# EAGLE design logic (EAGLE 4.16)
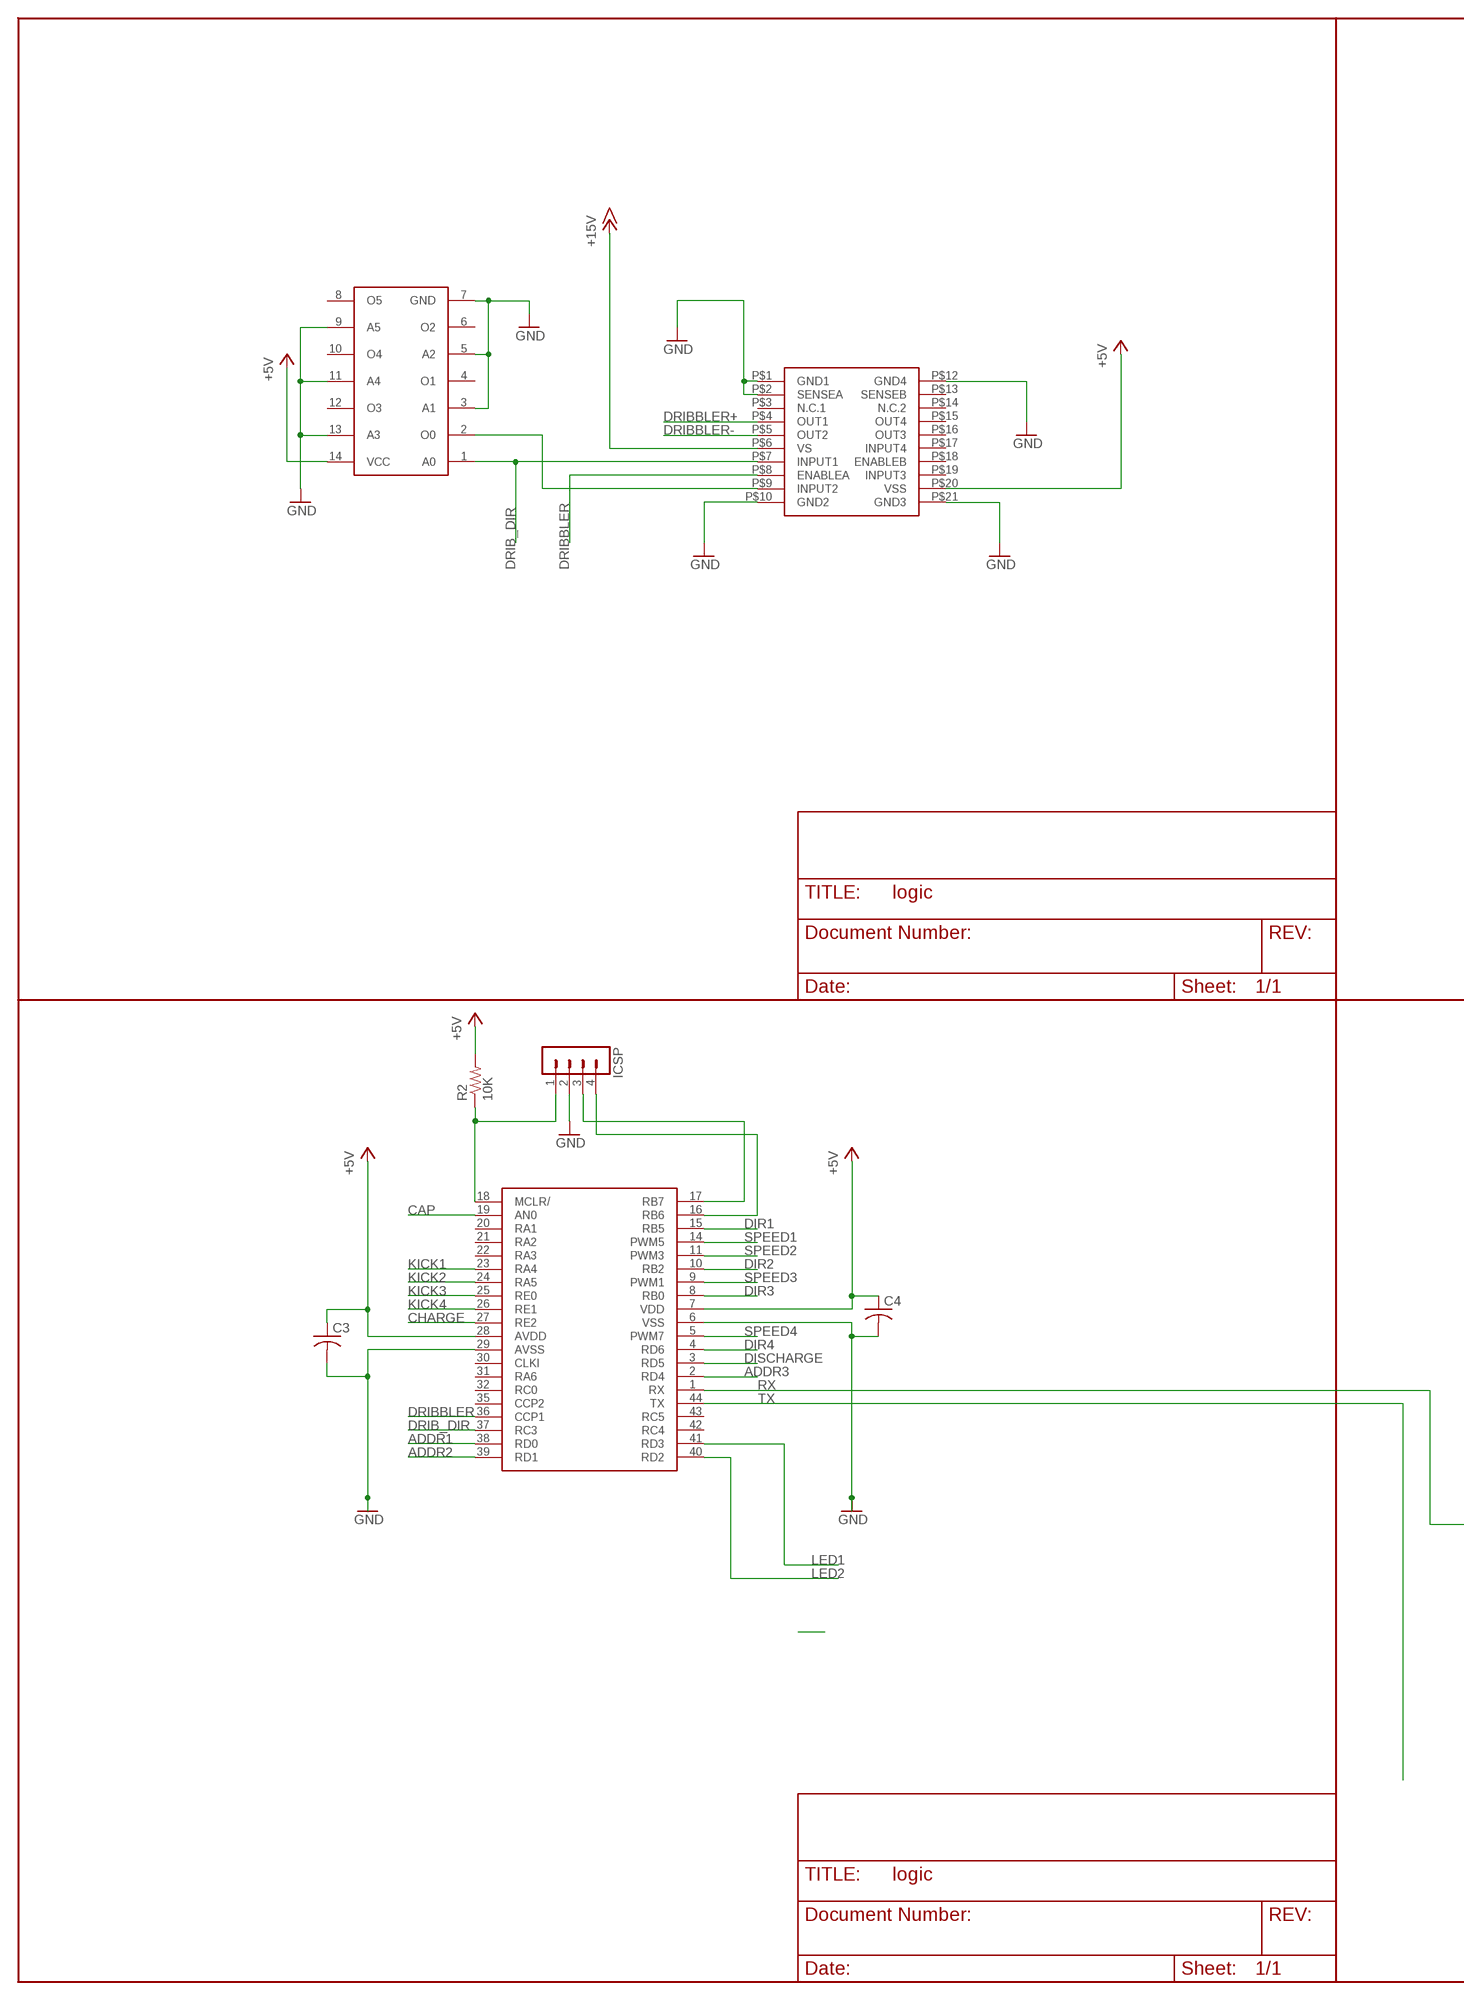
[diagram p0: schematic, sheet 1, part 1 of 2]
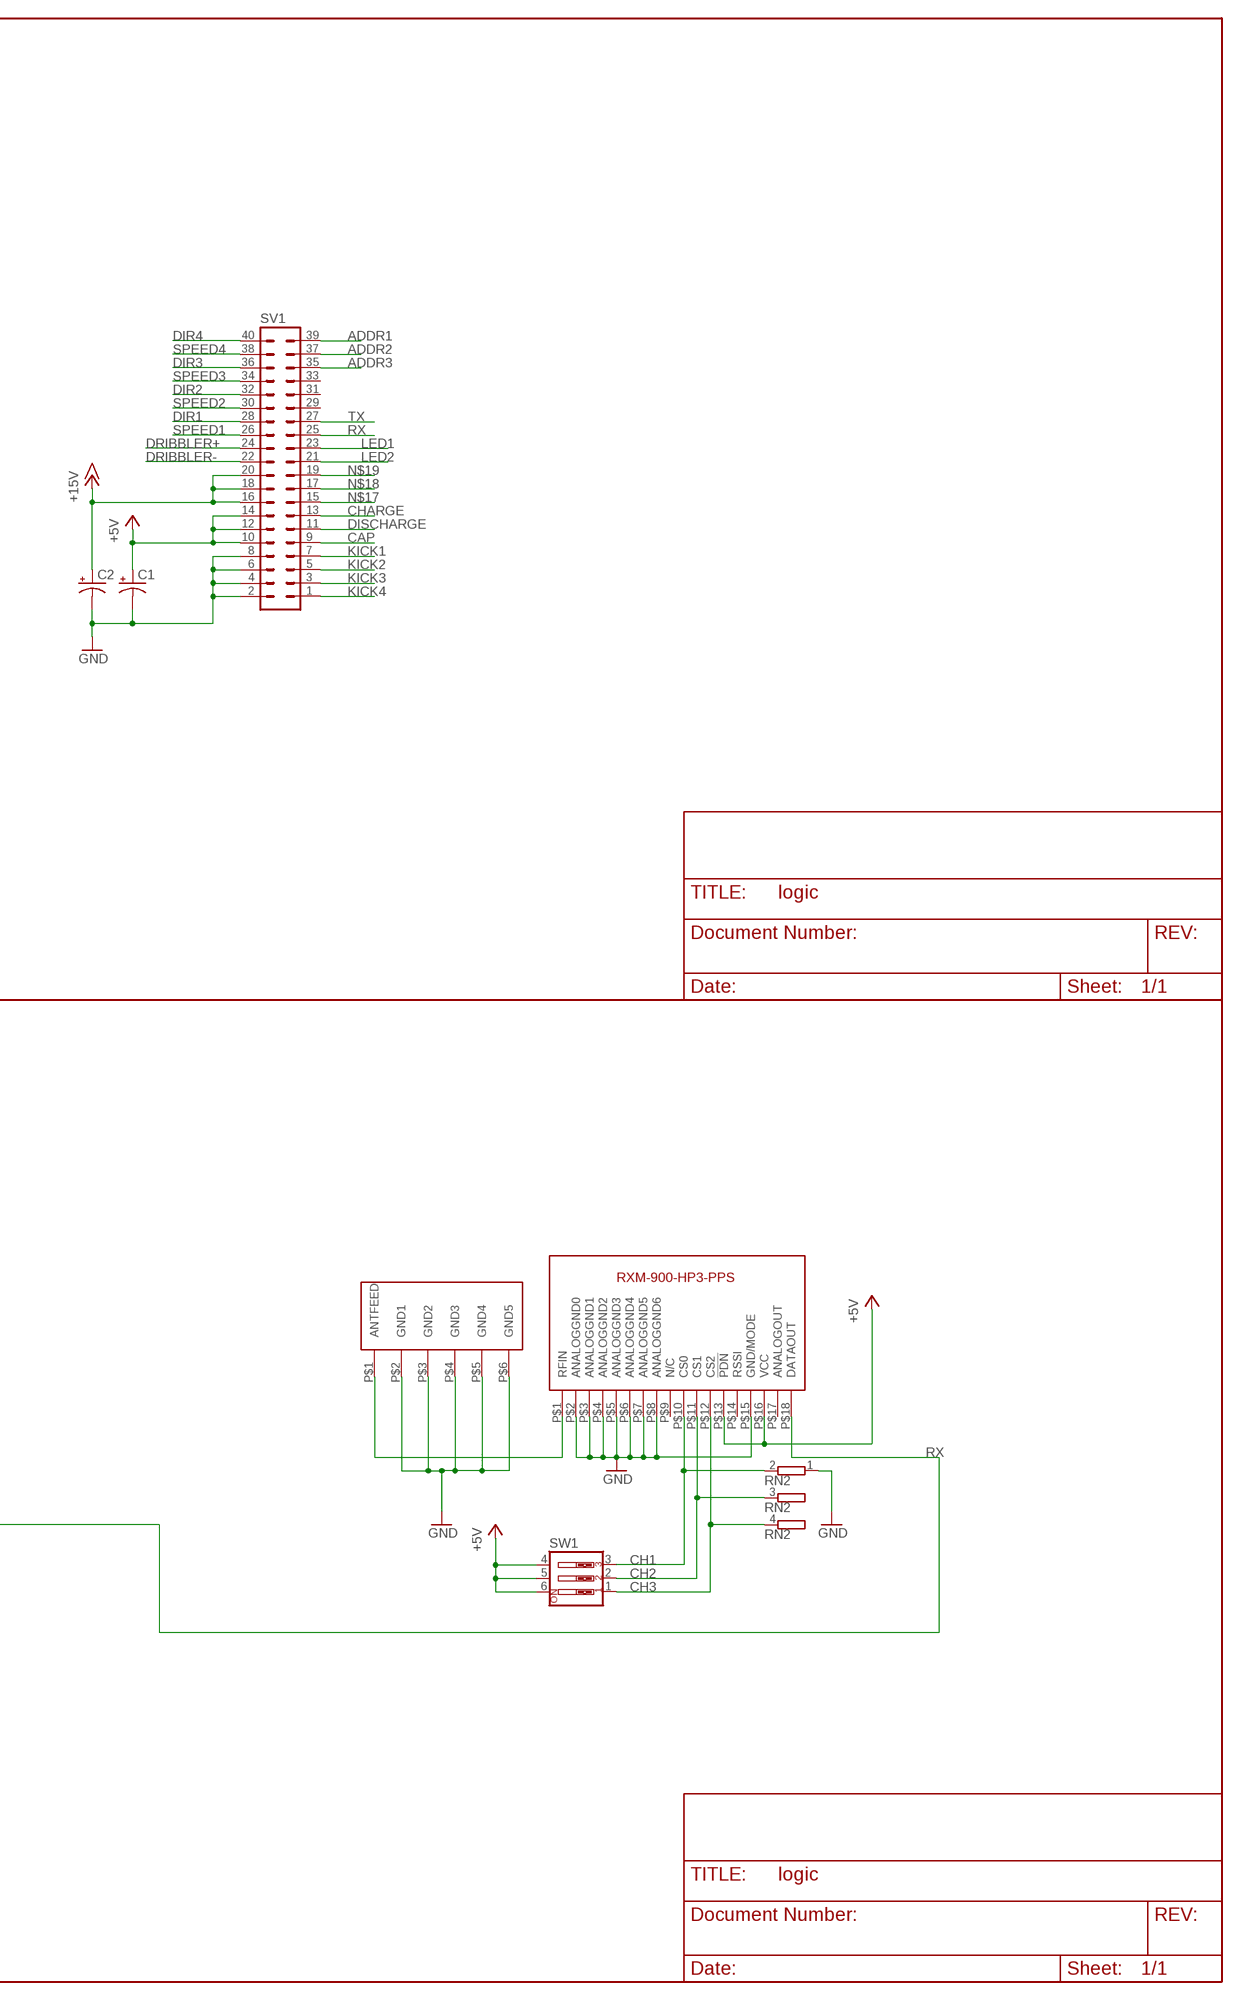
[diagram p1: schematic, sheet 1, part 2 of 2]

## Parts
C1  CPOL-USTT2D5  [TT2D5]
C2  CPOL-USTT2D5  [TT2D5]
C3  C-USC0805  [C0805]
C4  C-USC0805  [C0805]
IC1  PIC18F4431  [TQFP44]
IC2  L298  [L298]
IC3  INVERTER  [SOP14]
ICSP  MA04-1  [MA04-1]
R2  10K  R-US_R1206  [R1206]
RADIO  RXM-900-HP3-PPS  [SIP-18]
RN2  GE03RP  [SIL4]
SV1  MA20-2W  [MA20-2W]
SW1  SW_DIP-3  [EDG-03]
U$6  ANT-916-SP  [ANT-916-SP]

## Nets
+5V [supply]: C1.+ C3.1 C4.1 IC1.7(VDD) IC1.28(AVDD) IC2.P$20(VSS) IC3.14(VCC) R2.2 RADIO.P$13(!PDN) RADIO.P$16(VCC) SV1.10 SV1.12 SV1.14 SW1.4 SW1.5 SW1.6
+15V [supply]: C2.+ IC2.P$6(VS) SV1.16 SV1.18 SV1.20
ADDR1: IC1.38(RD0) SV1.39
ADDR2: IC1.39(RD1) SV1.37
ADDR3: IC1.2(RD4) SV1.35
CAP: IC1.19(AN0) SV1.9
CH1: RADIO.P$10(CS0) RN2.2 SW1.3
CH2: RADIO.P$11(CS1) RN2.3 SW1.2
CH3: RADIO.P$12(CS2) RN2.4 SW1.1
CHARGE: IC1.27(RE2) SV1.13
DIR1: IC1.15(RB5) SV1.28
DIR2: IC1.10(RB2) SV1.32
DIR3: IC1.8(RB0) SV1.36
DIR4: IC1.4(RD6) SV1.40
DISCHARGE: IC1.3(RD5) SV1.11
DRIB_DIR: IC1.37(RC3) IC2.P$7(INPUT1) IC3.1(A0)
DRIBBLER: IC1.36(CCP1) IC2.P$8(ENABLEA)
DRIBBLER+: IC2.P$4(OUT1) SV1.24
DRIBBLER-: IC2.P$5(OUT2) SV1.22
GND [supply]: C1.- C2.- C3.2 C4.2 IC1.6(VSS) IC1.29(AVSS) IC2.P$1(GND1) IC2.P$2(SENSEA) IC2.P$10(GND2) IC2.P$12(GND4) IC2.P$21(GND3) IC3.3(A1) IC3.5(A2) IC3.7(GND) IC3.9(A5) IC3.11(A4) IC3.13(A3) ICSP.2 RADIO.P$2(ANALOGGND0) RADIO.P$3(ANALOGGND1) RADIO.P$4(ANALOGGND2) RADIO.P$5(ANALOGGND3) RADIO.P$6(ANALOGGND4) RADIO.P$7(ANALOGGND5) RADIO.P$8(ANALOGGND6) RADIO.P$15(GND/MODE) RN2.1 SV1.2 SV1.4 SV1.6 SV1.8 U$6.P$2(GND1) U$6.P$3(GND2) U$6.P$4(GND3) U$6.P$5(GND4) U$6.P$6(GND5)
KICK1: IC1.23(RA4) SV1.7
KICK2: IC1.24(RA5) SV1.5
KICK3: IC1.25(RE0) SV1.3
KICK4: IC1.26(RE1) SV1.1
LED1: IC1.41(RD3) SV1.23
LED2: IC1.40(RD2) SV1.21
N$6: IC1.18(MCLR/) ICSP.1 R2.1
N$7: IC1.17(RB7) ICSP.3
N$8: IC1.16(RB6) ICSP.4
N$17: SV1.15
N$18: SV1.17
N$19: SV1.19
N$45: RADIO.P$1(RFIN) U$6.P$1(ANTFEED)
N$50: IC2.P$9(INPUT2) IC3.2(O0)
RX: IC1.1(RX) RADIO.P$18(DATAOUT) SV1.25
SPEED1: IC1.14(PWM5) SV1.26
SPEED2: IC1.11(PWM3) SV1.30
SPEED3: IC1.9(PWM1) SV1.34
SPEED4: IC1.5(PWM7) SV1.38
TX: IC1.44(TX) SV1.27
Unconnected: IC1.20(RA1) IC1.21(RA2) IC1.22(RA3) IC1.30(CLKI) IC1.31(RA6) IC1.32(RC0) IC1.35(CCP2) IC1.42(RC4) IC1.43(RC5) IC2.P$3(N.C.1) IC2.P$13(SENSEB) IC2.P$14(N.C.2) IC2.P$15(OUT4) IC2.P$16(OUT3) IC2.P$17(INPUT4) IC2.P$18(ENABLEB) IC2.P$19(INPUT3) IC3.4(O1) IC3.6(O2) IC3.8(O5) IC3.10(O4) IC3.12(O3) RADIO.P$9(N/C) RADIO.P$14(RSSI) RADIO.P$17(ANALOGOUT) SV1.29 SV1.31 SV1.33

## Library data of the parts
C1 C2 = rcl:CPOL-US: POLARIZED CAPACITOR, American symbol
C3 C4 = rcl:C-US: CAPACITOR, American symbol
IC1 = microchip:PIC18F4431
IC2 = L298:L298
IC3 = smd-ipc:INVERTER
ICSP = con-lstb:MA04-1: PIN HEADER
R2 = rcl:R-US_: RESISTOR, American symbol
RADIO = linxtechnologies:RXM-900-HP3-PPS
RN2 = resistor-sil:GE03RP: SIL RESISTOR
SV1 = con-lstb:MA20-2W: PIN HEADER
SW1 = special:SW_DIP-3: DIP SWITCH
U$6 = smd-oscillator:ANT-916-SP

## Net classes
1 supply: width 0.508 mm

## Board
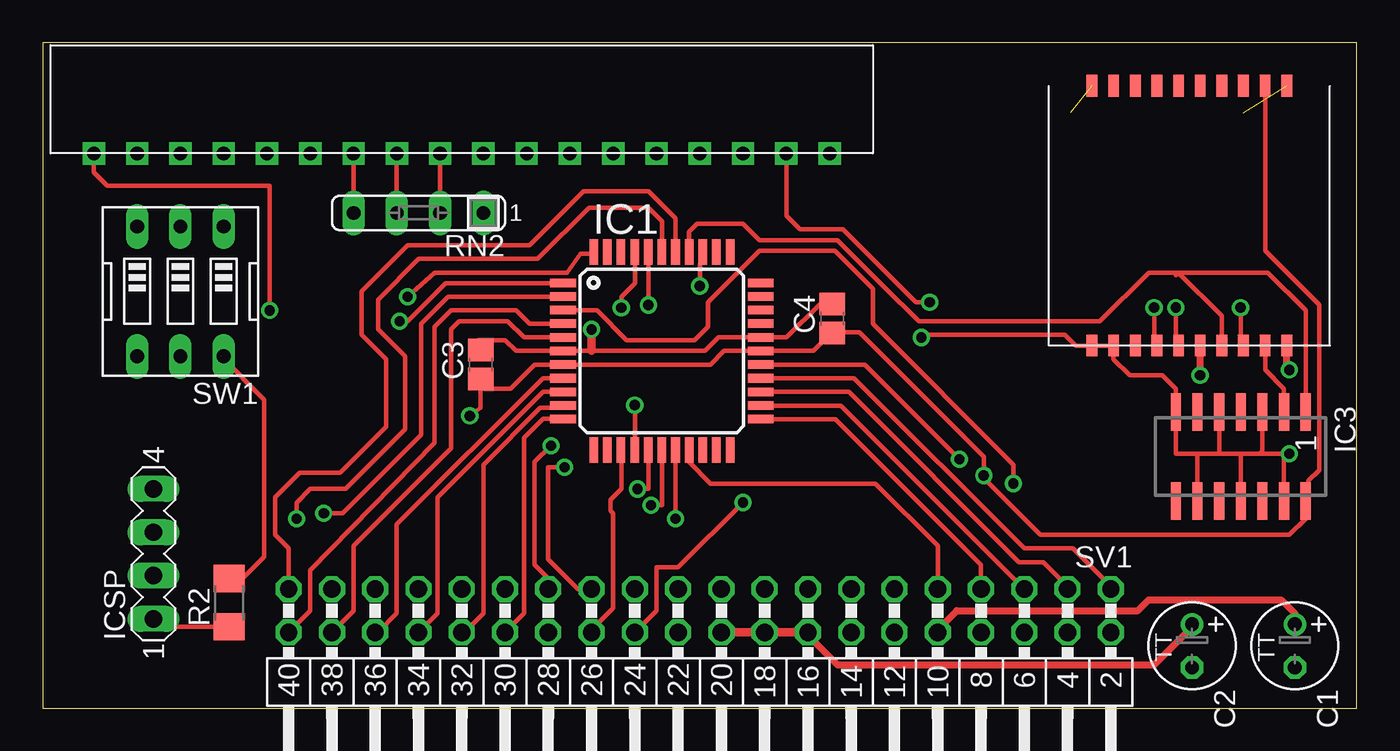
[diagram p2: board, top side]
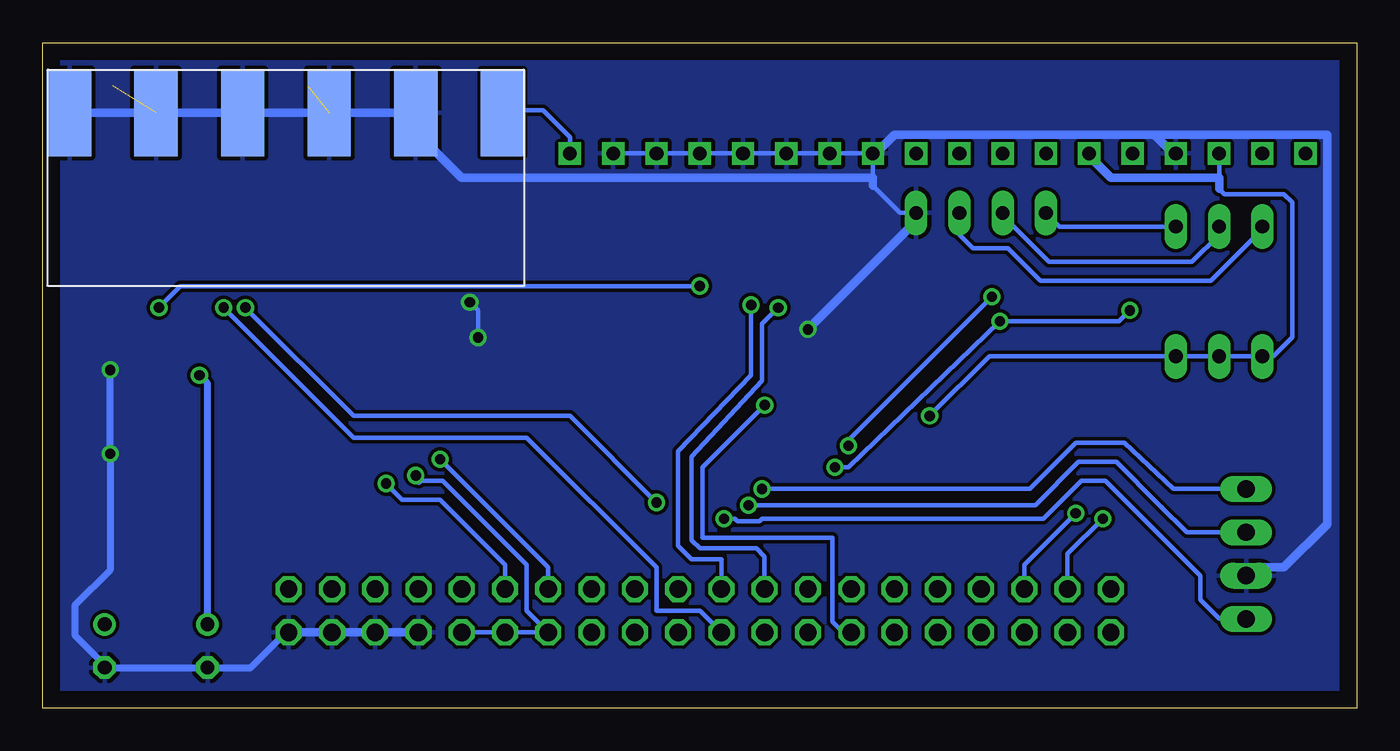
[diagram p3: board, bottom side, seen from below]

Size 77.14 x 39.04 mm. Coordinates in mm from the lower left corner, seen from the top.
Outline: 0,0 77.14,0 77.14,39.04 0,39.04 0,0
Copper layers (1*16): Top 0.035mm / dielectric 1.5mm / Bottom 0.035mm
Design rules "default": minimum track width 10mil, minimum drill 24mil, track to track 8mil, track to pad 8mil, pad to pad 8mil, via to via 8mil, smd to smd 8mil, copper to edge 40mil, drill to drill 8mil, minimum pad ring 10mil, minimum via ring 8mil, stop-mask expansion 4mil, vias tented up to drill 0mil, thermal gap 10mil

### Footprints (pad centres in the part's own frame; a part is rotated, then mirrored left to right if it is on the bottom)
TT2D5 = drill 0.813 round: + -1.27,0 | drill 0.813 octagon: - 1.27,0
C0805 = smd 1.3 x 1.5: 1 -0.85,0; 2 0.85,0
TQFP44 = smd 1.5 x 0.5: 1 -5.8,4; 2 -5.8,3.2; 3 -5.8,2.4; 4 -5.8,1.6; 5 -5.8,0.8; 6 -5.8,0; 7 -5.8,-0.8; 8 -5.8,-1.6; 9 -5.8,-2.4; 10 -5.8,-3.2; 11 -5.8,-4; 23 5.8,-4; 24 5.8,-3.2; 25 5.8,-2.4; 26 5.8,-1.6; 27 5.8,-0.8; 28 5.8,0; 29 5.8,0.8; 30 5.8,1.6; 31 5.8,2.4; 32 5.8,3.2; 33 5.8,4 | smd 0.5 x 1.5: 12 -4,-5.8; 13 -3.2,-5.8; 14 -2.4,-5.8; 15 -1.6,-5.8; 16 -0.8,-5.8; 17 0,-5.8; 18 0.8,-5.8; 19 1.6,-5.8; 20 2.4,-5.8; 21 3.2,-5.8; 22 4,-5.8; 34 4,5.8; 35 3.2,5.8; 36 2.4,5.8; 37 1.6,5.8; 38 0.8,5.8; 39 0,5.8; 40 -0.8,5.8; 41 -1.6,5.8; 42 -2.4,5.8; 43 -3.2,5.8; 44 -4,5.8
L298 = smd 0.635 x 1.27: P$1 2.54,0; P$2 3.81,0; P$3 5.08,0; P$4 6.35,0; P$5 7.62,0; P$6 8.89,0; P$7 10.16,0; P$8 11.43,0; P$9 12.7,0; P$10 13.97,0; P$12 2.54,15.24; P$13 3.81,15.24; P$14 5.08,15.24; P$15 6.35,15.24; P$16 7.62,15.24; P$17 8.89,15.24; P$18 10.16,15.24; P$19 11.43,15.24; P$20 12.7,15.24; P$21 13.97,15.24
SOP14 = smd 0.6 x 2.2: 1 -3.81,-2.6; 2 -2.54,-2.6; 3 -1.27,-2.6; 4 0,-2.6; 5 1.27,-2.6; 6 2.54,-2.6; 7 3.81,-2.6; 8 3.81,2.6; 9 2.54,2.6; 10 1.27,2.6; 11 0,2.6; 12 -1.27,2.6; 13 -2.54,2.6; 14 -3.81,2.6
MA04-1 = drill 1.016 long: 1 -3.81,0; 2 -1.27,0; 3 1.27,0; 4 3.81,0
R1206 = smd 1.6 x 1.803: 1 -1.422,0; 2 1.422,0
SIP-18 = drill 0.8 square: P$1 0,0; P$2 2.54,0; P$3 5.08,0; P$4 7.62,0; P$5 10.16,0; P$6 12.7,0; P$7 15.24,0; P$8 17.78,0; P$9 20.32,0; P$10 22.86,0; P$11 25.4,0; P$12 27.94,0; P$13 30.48,0; P$14 33.02,0; P$15 35.56,0; P$16 38.1,0; P$17 40.64,0; P$18 43.18,0
SIL4 = drill 0.813 long: 1 -3.81,0; 2 -1.27,0; 3 1.27,0; 4 3.81,0
MA20-2W = drill 1.016 octagon: 1 -24.13,-1.27; 2 -24.13,1.27; 3 -21.59,-1.27; 4 -21.59,1.27; 5 -19.05,-1.27; 6 -19.05,1.27; 7 -16.51,-1.27; 8 -16.51,1.27; 9 -13.97,-1.27; 10 -13.97,1.27; 11 -11.43,-1.27; 12 -11.43,1.27; 13 -8.89,-1.27; 14 -8.89,1.27; 15 -6.35,-1.27; 16 -6.35,1.27; 17 -3.81,-1.27; 18 -3.81,1.27; 19 -1.27,-1.27; 20 -1.27,1.27; 21 1.27,-1.27; 22 1.27,1.27; 23 3.81,-1.27; 24 3.81,1.27; 25 6.35,-1.27; 26 6.35,1.27; 27 8.89,-1.27; 28 8.89,1.27; 29 11.43,-1.27; 30 11.43,1.27; 31 13.97,-1.27; 32 13.97,1.27; 33 16.51,-1.27; 34 16.51,1.27; 35 19.05,-1.27; 36 19.05,1.27; 37 21.59,-1.27; 38 21.59,1.27; 39 24.13,-1.27; 40 24.13,1.27
EDG-03 = drill 0.813 long: 1 -2.54,-3.81; 2 0,-3.81; 3 2.54,-3.81; 4 2.54,3.81; 5 0,3.81; 6 -2.54,3.81
ANT-916-SP = smd 2.54 x 5.08: P$1 -7.62,0; P$2 -2.54,0; P$3 2.54,0; P$4 7.62,0; P$5 12.7,0; P$6 17.78,0

### Placement (x,y rotation side)
C1  73.5,3.65 270 top
C2  67.46,3.65 270 top
C3  25.71,20.16 90 top
C4  46.35,22.86 90 top
IC1  36.35,20.95 0 top
IC2  59.05,21.27 0 top
IC3  70.32,14.76 180 top
ICSP  6.5,9.04 90 top
R2  10.95,6.19 90 top
RADIO  46.19,32.54 180 top
RN2  22.06,29.05 180 top
SV1  38.57,5.71 180 top
SW1  8.09,24.44 180 top
U$6  57.78,34.92 180 bottom

### Tracks (layer width: path | path; a pad name or v marks a point on that pad's centre or on a via)
+5V  (via drill 0.6)  (1 unrouted)
  Top 0.254: 25.71,18.73 | 25.71,18.73 C3.1 25.71,17.62 v25.08,17.14 | 25.71,18.73 27.46,18.73 28.88,20.15 IC1.7 39.2,20.15 40,20.95 IC1.28 45.24,20.95 46.35,22.06 | 46.35,22.06 | 46.35,22.06 C4.1 | 46.35,22.06 47.94,22.06 55.24,14.76 v55.24,13.65 55.08,13.65 58.57,10.16 73.18,10.16 74.13,11.11 IC3.14 74.19,12.16 74.29,12.06 74.29,13.33 74.92,13.97 74.92,23.65 71.75,26.82 IC2.P$20 | 10.47,20.63 10.31,20.47 | 10.47,20.63 SW1.6 | 10.47,20.63 | R2.2 11.74,7.61 13.01,8.89 13.01,18.09 10.47,20.63 | 10.47,20.63
  Top 0.406: C1.+ 73.5,5.55 72.7,6.34 64.92,6.34 64.29,5.71 53.65,5.71 52.54,4.6 SV1.10
  Bottom 0.254: SV1.14 48.73,5.71 48.73,8.41 53.65,13.33 54.92,13.33 v55.24,13.65 | SV1.10 SV1.12 SV1.14 | SV1.14 47.3,4.44 | 8.09,31.11 RADIO.P$16 | 8.09,30.47 7.77,30.16 4.28,30.16 3.8,29.68 3.8,21.74 4.92,20.63 SW1.4 | SW1.4 | SW1.4 | SW1.4 8.41,20.63 SW1.5 SW1.6 | SW1.6 | SW1.6 10.79,20.47 | v25.08,17.14 21.58,20.63 10.47,20.63
  Bottom 0.508: v55.24,13.65 55.08,13.33 | RADIO.P$13 15.71,32.38 14.44,31.11 8.09,31.11 8.09,30.47
+15V  (via drill 0.6)
  Top 0.406: SV1.16 44.92,4.28 46.67,2.54 65.24,2.54 67.62,4.92 | 67.62,4.92 | 67.62,4.92 C2.+ | 67.94,21.43 | 67.94,21.43 IC2.P$6 | v67.94,19.52 67.94,21.43
  Top 0.508: SV1.20 SV1.18 SV1.16
  Bottom 0.406: C2.+ 67.46,19.04 v67.94,19.52
ADDR1
  Top 0.254: SV1.39 14.44,9.36 13.65,10.16 13.65,12.38 15.08,13.81 17.46,13.81 20.15,16.5 20.15,20.47 18.73,21.9 18.73,24.44 21.42,27.14 28.57,27.14 31.74,30.32 35.55,30.32 37.14,28.73 37.14,26.82 37.15,26.82 IC1.38
ADDR2  (via drill 0.6)
  Top 0.254: v14.92,11.11 14.92,12.06 15.71,12.85 17.77,12.85 20.95,16.03 | 20.95,16.03 | 20.95,16.03 21.27,16.35 21.27,20.63 19.68,22.22 19.68,23.97 22.06,26.35 29.04,26.35 32.06,29.36 35.55,29.36 36.35,28.57 36.35,26.66 IC1.39
  Bottom 0.254: SV1.37 16.98,9.04 v14.92,11.11
ADDR3  (via drill 0.6)
  Top 0.254: v16.5,11.43 17.61,11.43 22.22,16.03 22.22,22.54 23.81,24.12 30.63,24.12 30.61,24.15 IC1.2
  Bottom 0.254: SV1.35 19.52,8.41 v16.5,11.43
CAP
  Top 0.254: SV1.9 52.54,9.52 48.89,13.17 39.2,13.17 37.94,14.44 37.94,15.24 37.95,15.22 IC1.19
CH1
  Top 0.254: RN2.2 23.33,28.89 | 23.33,28.89 RADIO.P$10 | 23.33,28.89 23.17,28.73
  Bottom 0.254: SW1.3 5.55,28.09 8.57,25.08 18.57,25.08 20.47,26.98 22.54,26.98 23.33,27.78 RN2.2
CH2
  Top 0.254: RN2.3 RADIO.P$11
  Bottom 0.254: SW1.2 8.09,27.78 9.68,26.19 18.09,26.19 20.79,28.89 RN2.3
CH3
  Top 0.254: 18.25,28.89 RN2.4 RADIO.P$12
  Bottom 0.254: SW1.1 17.46,28.25 RN2.4
CHARGE  (via drill 0.6)
  Top 0.254: v53.81,14.6 | v53.81,14.6 48.25,20.16 41.9,20.16 41.91,20.15 IC1.27
  Bottom 0.254: SV1.13 47.46,8.25 v53.81,14.6
DIR1  (via drill 0.6)
  Top 0.254: IC1.15 34.75,14.93 34.76,14.92 v34.76,17.77
  Bottom 0.254: SV1.28 30.16,4.44 30.79,5.08 30.79,10 38.41,10 38.41,14.12 v34.76,17.77
DIR2
  Top 0.254: SV1.32 24.76,4.44 25.87,5.55 25.87,14.28 29.2,17.62 30.79,17.62 30.66,17.75 IC1.10
DIR3
  Top 0.254: SV1.36 19.68,4.44 20.79,5.55 20.79,10.79 29.36,19.36 30.63,19.36 30.62,19.35 IC1.8
DIR4
  Top 0.254: SV1.40 15.71,5.71 15.71,8.09 23.01,15.55 23.01,22.38 23.96,23.33 27.77,23.33 28.57,22.54 30.47,22.54 30.49,22.55 IC1.4
DISCHARGE  (via drill 0.6)
  Top 0.254: v56.98,13.17 56.98,14.28 48.73,22.54 48.73,24.6 46.51,26.82 42.06,26.82 39.05,23.81 39.05,22.38 38.25,21.58 34.28,21.58 32.54,23.33 30.47,23.33 30.49,23.35 IC1.3
  Bottom 0.254: SV1.11 50,8.41 53.81,12.22 56.03,12.22 v56.98,13.17
DRIB_DIR
  Top 0.254: IC1.37 37.95,27.95 38.41,28.41 41.11,28.41 42.06,27.46 46.67,27.46 49.37,24.76 51.43,22.7 62.06,22.7 64.92,25.55 66.51,25.55 | 66.51,25.55 66.67,25.55 | 66.67,25.55 69.21,23.01 IC2.P$7 | IC2.P$7 | IC3.1 74.13,23.33 71.91,25.55 66.67,25.55 | 66.51,25.55 66.51,25.39 66.67,25.55
DRIBBLER  (via drill 0.61)
  Top 0.254: v70.32,23.49 70.32,20.95 IC2.P$8 | v38.57,24.76 38.57,26.03 IC1.36
  Bottom 0.254: v70.32,23.49 69.05,24.76 v38.57,24.76
DRIBBLER+  (via drill 0.61)
  Top 0.254: v65.24,23.49 65.24,20.95 IC2.P$4 | v41.11,12.06 37.3,8.25 36.03,8.25 36.03,5.71 SV1.24
  Bottom 0.254: v65.24,23.49 58.89,17.14 46.19,17.14 v41.11,12.06
DRIBBLER-  (via drill 0.61)
  Top 0.254: v66.51,23.49 66.51,20.95 IC2.P$5
  Bottom 0.254: v66.51,23.49 58.89,15.87 48.73,15.87 41.11,8.25 41.11,5.71 38.57,5.71 SV1.22
GND  (via drill 0.6, 0.61)  (2 unrouted)
  Top 0.254: C3.2 25.58,21.56 25.55,21.58 27.14,21.58 27.77,20.95 IC1.6 32.22,20.95 38.89,20.95 39.68,21.74 41.9,21.74 | 41.9,21.74 42.22,21.74 42.21,21.75 IC1.29 41.91,21.75 41.9,21.74 | C4.2 45.61,23.7 43.65,21.74 41.9,21.74 | 66.51,14.92 IC3.7 66.51,17.3 | 66.51,14.92 | 67.78,14.92 69.05,14.92 | 66.51,14.92 67.78,14.92 | 69.05,17.3 | 69.05,17.3 IC3.5 | 69.05,14.92 69.05,17.3 | IC3.11 70.32,14.92 | 69.05,14.92 70.32,14.92 | 71.59,15.08 IC3.3 71.59,14.92 | 71.59,15.08 | 71.43,14.92 71.59,15.08 | 70.32,14.92 71.43,14.92 | IC3.9 67.78,14.92 | IC3.13 72.86,14.92 72.7,14.92 71.59,14.92 | 71.43,14.92 71.59,14.92 | 71.59,14.92 v73.18,14.92 | 66.51,17.3 | 66.51,17.3 66.51,18.73 65.72,19.52 63.81,19.52 62.86,20.47 IC2.P$2 63.02,21.27 | 63.02,21.27 IC2.P$1 60.64,21.27 60,21.9 51.75,21.9 v51.59,21.74 | 63.02,21.27 | v52.06,23.81 51.27,23.81 46.98,28.09 44.44,28.09 43.65,28.89 RADIO.P$2 | RADIO.P$2 | RADIO.P$2 43.49,32.7 | RADIO.P$8
  Top 0.406: IC2.P$10 73.02,20.31 v73.18,19.84
  Top 0.508: v32.22,22.22 32.22,20.95
  Bottom 0.254: RN2.1 26.82,29.05 28.41,30.63 | RADIO.P$8 | 28.41,32.38 28.41,31.11 | RADIO.P$8 RADIO.P$7 | RADIO.P$7 31.11,32.54 | 31.11,32.54 | RADIO.P$7 RADIO.P$6 | RADIO.P$6 33.81,32.54 | 33.81,32.54 | RADIO.P$5 | RADIO.P$6 RADIO.P$5 | RADIO.P$5 | RADIO.P$5 RADIO.P$4 | RADIO.P$4 38.73,32.54 | 38.73,32.54 | RADIO.P$4 RADIO.P$3 | RADIO.P$3 41.27,32.54 | 41.27,32.54 | 43.81,32.54 RADIO.P$2 | RADIO.P$3 43.81,32.54 | 43.81,32.54 | v51.59,21.74 51.59,23.33 v52.06,23.81
  Bottom 0.406: v73.18,19.84 v73.18,14.92 73.18,8.09 75.24,6.03 75.24,4.28 73.34,2.38 C1.- | C1.- | C1.- C2.- 64.92,2.38 62.86,4.44 SV1.2 | C1.-
  Bottom 0.508: SV1.8 SV1.6 SV1.4 SV1.2 | U$6.P$6 U$6.P$5 U$6.P$4 U$6.P$3 U$6.P$2 55.08,33.65 52.54,31.11 28.41,31.11 28.41,30.63 | 11.9,33.65 10.63,32.38 RADIO.P$15 | 11.9,33.65 27.14,33.65 28.41,32.38 RADIO.P$8 | 11.9,33.65 1.74,33.65 1.74,10.79 4.28,8.25 5.55,8.25 ICSP.2 | v32.22,22.22 25.87,28.57 RN2.1
  pour Bottom: -1.12,-1.12 78.58,-1.12 78.58,40.32 -1.12,40.32
KICK1
  Top 0.254: IC1.23 46.54,16.95 55.08,8.41 SV1.7
KICK2
  Top 0.254: IC1.24 46.85,17.75 SV1.5
KICK3
  Top 0.254: IC1.25 47.32,18.55 57.3,8.57 58.73,8.57 60.16,7.14 SV1.3
KICK4
  Top 0.254: IC1.26 47.63,19.35 57.62,9.36 60.48,9.36 62.7,7.14 SV1.1
LED1  (via drill 0.6)
  Top 0.254: v33.97,23.49 33.97,24.12 34.76,24.92 34.76,26.98 34.75,26.97 IC1.41
  Bottom 0.254: SV1.23 34.76,8.89 35.24,9.36 38.57,9.36 39.05,9.84 39.05,14.76 34.92,19.2 34.92,22.54 v33.97,23.49
LED2  (via drill 0.6)
  Top 0.254: v35.55,23.65 35.55,24.76 35.55,26.66 35.55,26.67 IC1.40
  Bottom 0.254: SV1.21 37.3,8.73 39.05,8.73 39.84,9.52 39.84,15.08 35.55,19.52 v35.55,23.65
N$6  (via drill 0.6)
  Top 0.254: IC1.18 37.15,11.91 v37.14,11.11 | ICSP.1 6.66,5.23 7.13,4.76 R2.1
  Bottom 0.254: v37.14,11.11 36.51,11.11 36.35,10.95 35.08,10.95 34.92,11.11 18.41,11.11 16.19,13.33 14.76,13.33 11.74,10.31 | 11.74,10.31 | 11.74,10.31 9.2,7.77 9.2,6.34 8.09,5.23 ICSP.1 6.34,5.23
N$7  (via drill 0.6)
  Top 0.254: IC1.17 36.35,12.06 36.35,11.9 v35.71,11.9
  Bottom 0.254: v35.71,11.9 18.88,11.9 16.34,14.44 14.12,14.44 11.58,11.9 | 11.58,11.9 11.42,11.74 | ICSP.3 10,10.31 11.58,11.9
N$8  (via drill 0.6)
  Top 0.254: IC1.16 35.55,15.23 35.55,15.24 35.55,12.85 v34.92,12.85
  Bottom 0.254: v34.92,12.85 19.2,12.85 16.5,15.55 13.65,15.55 10.79,12.85 ICSP.4
N$45
  Bottom 0.254: RADIO.P$1 46.19,33.49 47.78,35.08 50.16,35.08 | 50.16,35.08 | 50.16,35.08 U$6.P$1
N$50
  Top 0.254: IC2.P$9 71.75,19.84 72.86,18.73 72.86,17.3 | 72.86,17.3 | 72.86,17.3 IC3.2
RX  (via drill 0.6)
  Top 0.254: SV1.25 31.43,6.98 29.68,8.73 29.68,14.12 v30.63,14.12 | v20.95,22.7 21.42,22.7 23.65,24.92 30.63,24.92 30.76,24.95 | 30.76,24.95 30.79,24.92 | 30.76,24.95 IC1.1 | RADIO.P$18 3.01,31.43 3.8,30.63 13.33,30.63 v13.33,23.33
  Bottom 0.254: v30.63,14.12 29.84,14.12 v20.95,22.7 13.96,22.7 v13.33,23.33
SPEED1
  Top 0.254: SV1.26 32.22,4.6 33.49,5.87 33.49,11.43 33.33,11.58 33.33,12.22 33.97,12.85 33.97,15.08 33.95,15.1 IC1.14
SPEED2
  Top 0.254: SV1.30 28.25,5.55 28.25,15.87 29.36,16.98 30.95,16.98 30.92,16.95 IC1.11
SPEED3
  Top 0.254: SV1.34 23.17,5.55 23.17,12.38 29.36,18.57 30.63,18.57 30.61,18.55 IC1.9
SPEED4
  Top 0.254: IC1.5 28.24,21.75 27.3,22.7 24.44,22.7 23.96,22.22 23.96,15.24 18.25,9.52 18.25,5.71 SV1.38
TX  (via drill 0.6)
  Top 0.254: SV1.27 29.68,7.62 28.89,8.41 28.89,14.44 v29.84,15.39 | v21.42,24.12 23.01,25.55 30.79,25.55 31.58,26.66 32.38,26.66 32.38,26.82 32.35,26.79 IC1.44
  Bottom 0.254: v29.84,15.39 29.84,15.71 v21.42,24.12